# EAGLE schematic M_C_ext_main_ftdi (EAGLE 9.6.2)
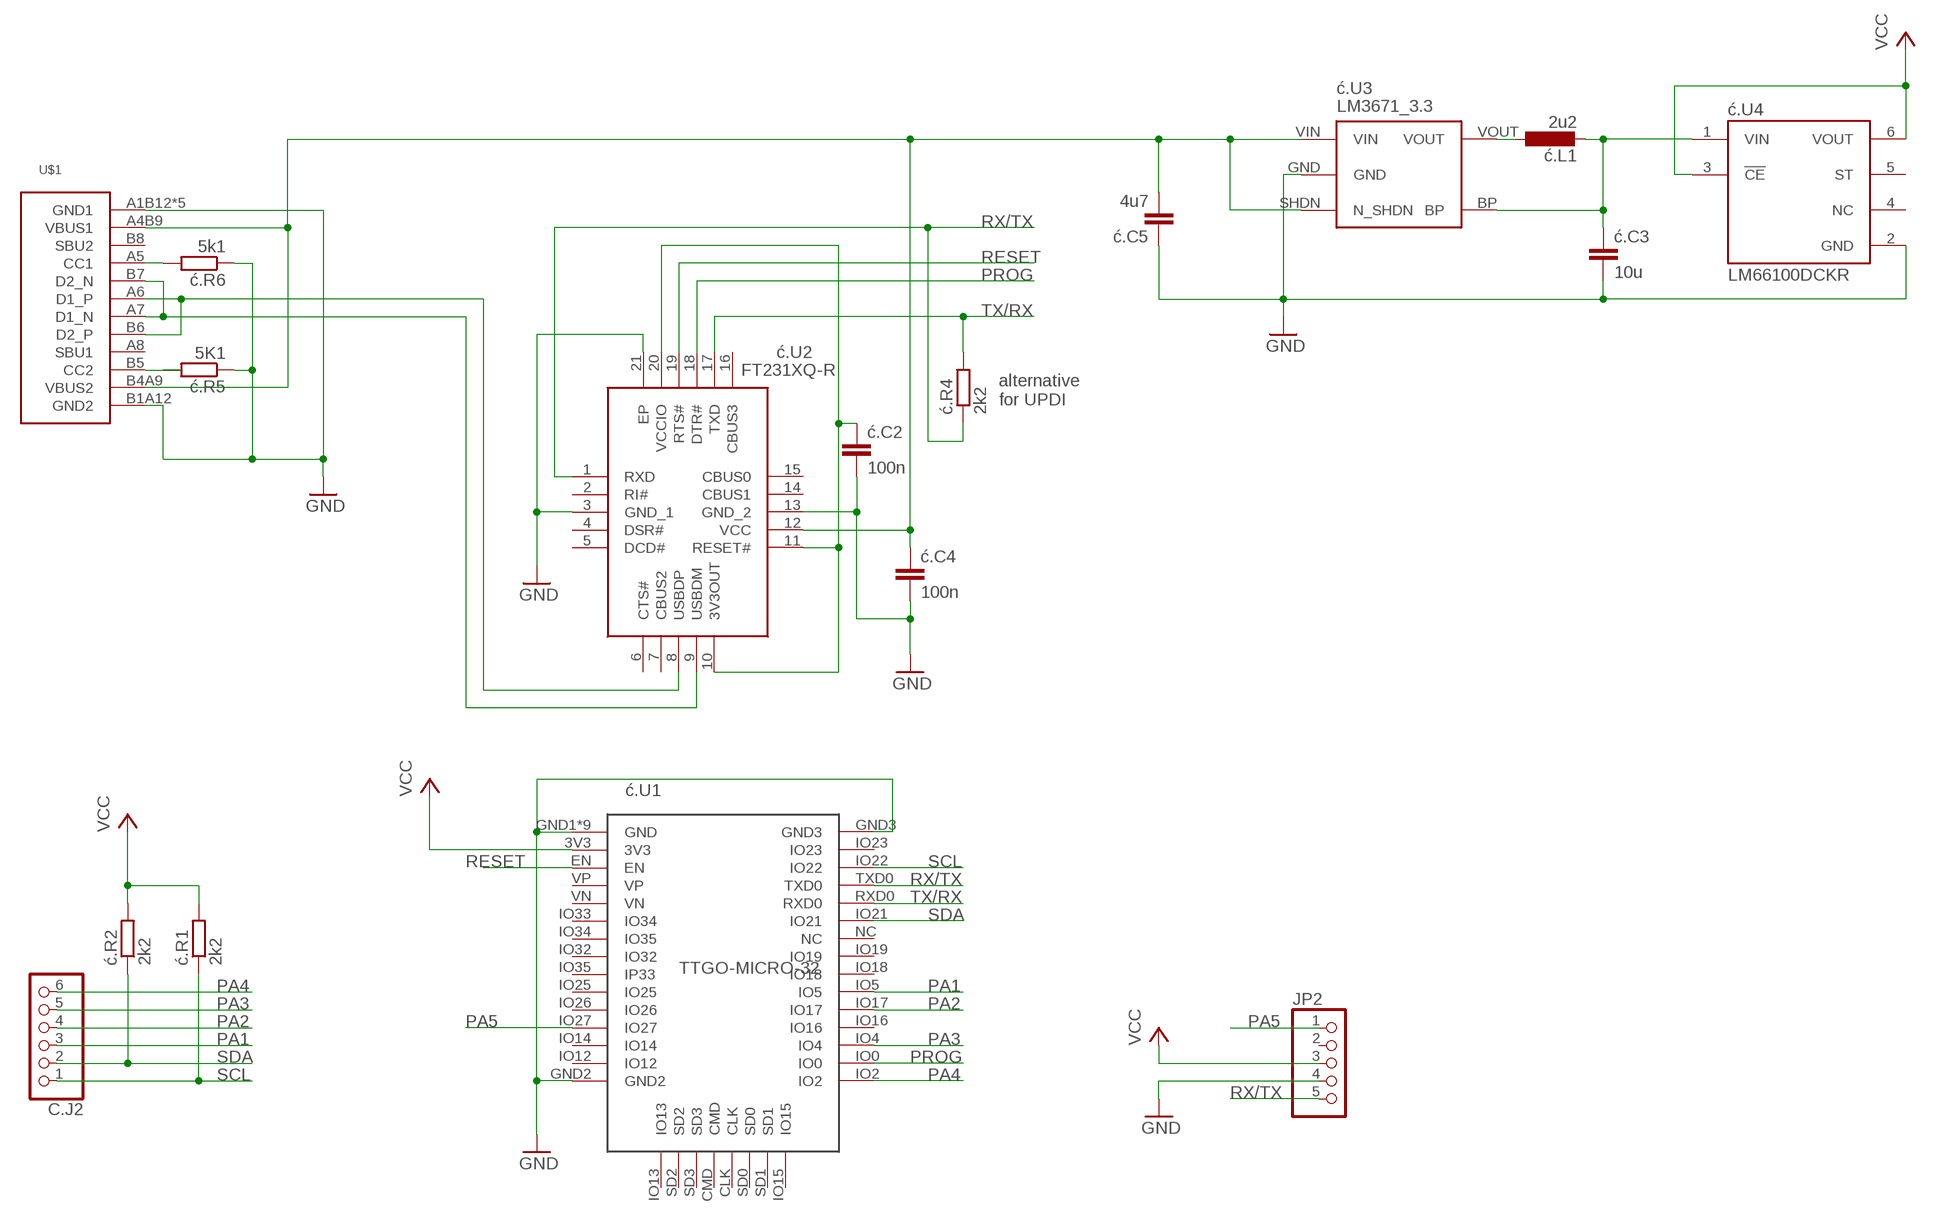
[diagram p0: schematic, sheet 1]

## Parts
C.J2  PINHD-1X6  [1X06]
JP2  PINHD-1X5  [1X05]
U$1  USB-C  [USB-C]
ć.C2  100n  C-EUC0603  [C0603]
ć.C3  10u  C-EUC0603  [C0603]
ć.C4  100n  C-EUC0603  [C0603]
ć.C5  4u7  C-EUC0603  [C0603]
ć.L1  2u2  L-EUL3230M  [L3230M]
ć.R1  2k2  R-EU_R0603  [R0603]
ć.R2  2k2  R-EU_R0603  [R0603]
ć.R4  2k2  R-EU_R0603  [R0603]
ć.R5  5K1  R-EU_R0603  [R0603]
ć.R6  5k1  R-EU_R0603  [R0603]
ć.U1  TTGO-MICRO-32  [TTGO-MICRO-32]
ć.U2  FT231XQ-R  [QFN50P400X400X80-21N]
ć.U3  LM3671_3.3  STABILISER_APE8865  [SOT32-5]
ć.U4  LM66100DCKR  [SOT65P210X110-6N]

## Nets
GND: JP2.4 U$1.A1B12(GND1) U$1.B1A12(GND2) U$1.SH1(GND1) U$1.SH2(GND1) U$1.SH3(GND1) U$1.SH4(GND1) ć.C2.2 ć.C3.2 ć.C4.2 ć.C5.1 ć.R5.1 ć.R6.1 ć.U1.GND1(GND) ć.U1.GND2 ć.U1.GND3 ć.U1.GND4(GND) ć.U1.GND5(GND) ć.U1.GND6(GND) ć.U1.GND7(GND) ć.U1.GND8(GND) ć.U1.GND9(GND) ć.U1.GND10(GND) ć.U1.GND11(GND) ć.U2.3(GND_1) ć.U2.13(GND_2) ć.U2.21(EP) ć.U3.GND ć.U4.2(GND)
N$1: U$1.A7(D1_N) U$1.B7(D2_N) ć.U2.9(USBDM)
N$2: U$1.A6(D1_P) U$1.B6(D2_P) ć.U2.8(USBDP)
N$3: U$1.A5(CC1) ć.R6.2
N$4: U$1.B5(CC2) ć.R5.2
N$10: ć.L1.1 ć.U3.VOUT
N$15: ć.C2.1 ć.U2.10(3V3OUT) ć.U2.11(RESET#) ć.U2.20(VCCIO)
PA1: C.J2.3 ć.U1.IO5
PA2: C.J2.4 ć.U1.IO17
PA3: C.J2.5 ć.U1.IO4
PA4: C.J2.6 ć.U1.IO2
PA5: JP2.1 ć.U1.IO27
PROG: ć.U1.IO0 ć.U2.18(DTR#)
RESET: ć.U1.EN ć.U2.19(RTS#)
RX/TX: JP2.5 ć.R4.1 ć.U1.TXD0 ć.U2.1(RXD)
SCL: C.J2.1 ć.R1.1 ć.U1.IO22
SDA: C.J2.2 ć.R2.1 ć.U1.IO21
TX/RX: ć.R4.2 ć.U1.RXD0 ć.U2.17(TXD)
VCC: JP2.3 ć.R1.2 ć.R2.2 ć.U1.3V3 ć.U4.3(!CE) ć.U4.6(VOUT)
VCC1: ć.C3.1 ć.L1.2 ć.U3.BP ć.U4.1(VIN)
VUSB: U$1.A4B9(VBUS1) U$1.B4A9(VBUS2) ć.C4.1 ć.C5.2 ć.U2.12(VCC) ć.U3.SHDN(N_SHDN) ć.U3.VIN
Unconnected: JP2.2 U$1.A8(SBU1) U$1.B8(SBU2) ć.U1.CLK ć.U1.CMD ć.U1.IO12 ć.U1.IO13 ć.U1.IO14 ć.U1.IO15 ć.U1.IO16 ć.U1.IO18 ć.U1.IO19 ć.U1.IO23 ć.U1.IO25 ć.U1.IO26 ć.U1.IO32 ć.U1.IO33(IO34) ć.U1.IO34(IO35) ć.U1.IO35(IP33) ć.U1.NC ć.U1.SD0 ć.U1.SD1 ć.U1.SD2 ć.U1.SD3 ć.U1.VN ć.U1.VP ć.U2.2(RI#) ć.U2.4(DSR#) ć.U2.5(DCD#) ć.U2.6(CTS#) ć.U2.7(CBUS2) ć.U2.14(CBUS1) ć.U2.15(CBUS0) ć.U2.16(CBUS3) ć.U4.4(NC) ć.U4.5(ST)

## Notes on the sheet
- alternative
  for UPDI

## Library data of the parts
C.J2 = pinhead2:PINHD-1X6: PIN HEADER
JP2 = pinhead2:PINHD-1X5: PIN HEADER
U$1 = hugo:USB-C
ć.C2-ć.C5 = rcl:C-EU: CAPACITOR, European symbol; SPICEPREFIX: C
ć.L1 = rcl:L-EU: INDUCTOR, European symbol; SPICEPREFIX: L
ć.R1 ć.R2 ć.R4-ć.R6 = rcl:R-EU_: RESISTOR, European symbol; SPICEPREFIX: R
ć.U1 = hugo:TTGO-MICRO-32
ć.U2 = FT231XQ-R:FT231XQ-R: FTDI Chip FT231XQ-R, USB Transceiver Source: Datasheet <http://www.ftdichip.com/Support/Documents/DataSheets/ICs/DS_FT231X.pdf>; DESCRIPTION: FTDI Chip FT231XQ-R, USB Transceiver; HEIGHT: 0.8mm; MANUFACTURER_NAME: FTDI Chip; MANUFACTURER_PART_NUMBER: FT231XQ-R
ć.U3 = !stavebnice03:STABILISER_APE8865
ć.U4 = LM66100DCKR:LM66100DCKR: Check availability <https://pricing.snapeda.com/parts/LM66100DCKR/Texas%20Instruments/view-part?ref=eda>; AVAILABILITY: In Stock; CHECK_PRICES: https://www.snapeda.com/parts/LM66100DCKR/Texas+Instruments/view-part/?ref=eda; DESCRIPTION: 1.5-V to 5.5-V, 1.5-A, 0.5-µA IQ ideal diode with integrated FET; MF: Texas Instruments; MP: LM66100DCKR; PACKAGE: SOT-SC70-6 Texas Instruments; PRICE: None; SNAPEDA_LINK: https://www.snapeda.com/parts/LM66100DCKR/Texas+Instruments/view-part/?ref=snap